# Altium schematic sheet ADC_01_HYB.SchDoc: ADC01 Hybrid
size A4; DrawnBy: HK; SheetNumber: 1; SheetTotal: 2; ProjectName: CoRDIA
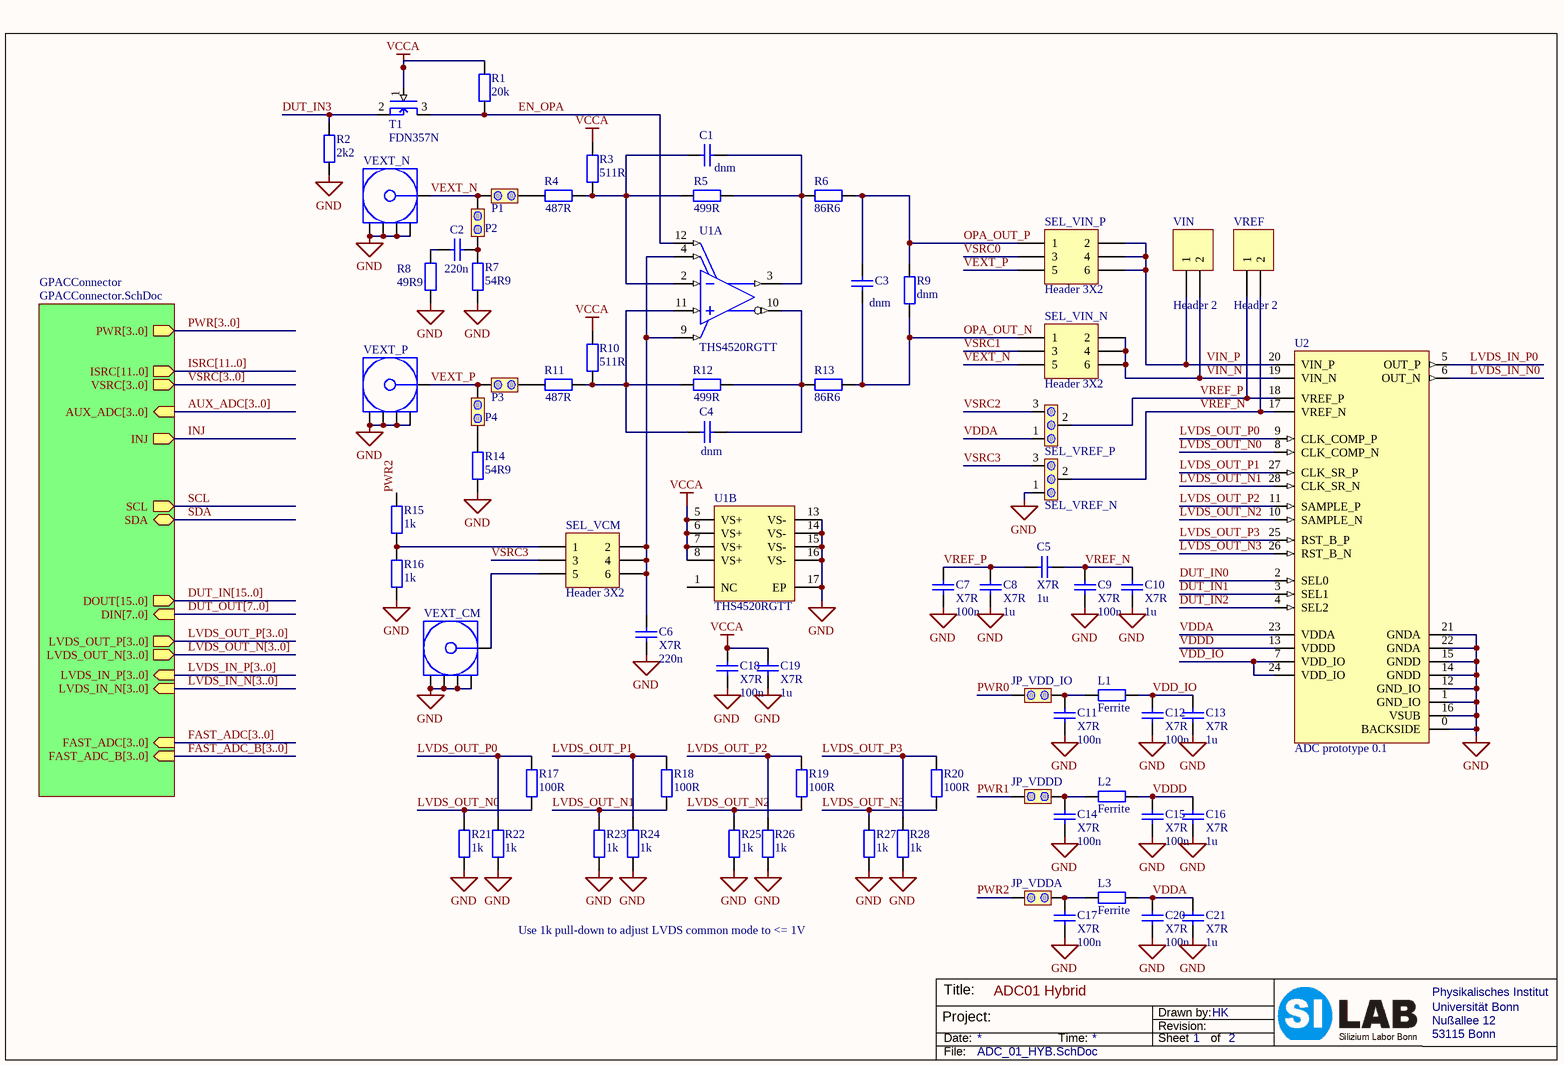
[diagram p0: ADC_01_HYB.SchDoc]

## Parts
C1  value dnm  [C0603_imp_N]  (hidden comment: X7R)
C2  value 220n  [C0603_imp_N]  (hidden comment: X7R)
C3  value dnm  [C0603_imp_N]  (hidden comment: X7R)
C4  value dnm  [C0603_imp_N]  (hidden comment: X7R)
C5  X7R  value 1u  [C0603_imp_N]
C6  X7R  value 220n  [C0603_imp_N]
C7  X7R  value 100n  [C0603_imp_N]
C8  X7R  value 1u  [C0603_imp_N]
C9  X7R  value 100n  [C0603_imp_N]
C10  X7R  value 1u  [C0603_imp_N]
C11  X7R  value 100n  [C0603_imp_N]
C12  X7R  value 100n  [C0603_imp_N]
C13  X7R  value 1u  [C0603_imp_N]
C14  X7R  value 100n  [C0603_imp_N]
C15  X7R  value 100n  [C0603_imp_N]
C16  X7R  value 1u  [C0603_imp_N]
C17  X7R  value 100n  [C0603_imp_N]
C18  X7R  value 100n  [C0603_imp_N]
C19  X7R  value 1u  [C0603_imp_N]
C20  X7R  value 100n  [C0603_imp_N]
C21  X7R  value 1u  [C0603_imp_N]
JP_VDD_IO  -  [CON 1x2 std]  (value not drawn)
JP_VDDA  -  [CON 1x2 std]  (value not drawn)
JP_VDDD  -  [CON 1x2 std]  (value not drawn)
L1  value Ferrite  [R0603_imp_N]  (hidden comment: R)
L2  value Ferrite  [R0603_imp_N]  (hidden comment: R)
L3  value Ferrite  [R0603_imp_N]  (hidden comment: R)
P1  -  [CON 1x2 std]  (value not drawn)
P2  -  [CON 1x2 std]  (value not drawn)
P3  -  [CON 1x2 std]  (value not drawn)
P4  -  [CON 1x2 std]  (value not drawn)
R1  value 20k  [R0603_imp_N]  (hidden comment: R)
R2  value 2k2  [R0603_imp_N]  (hidden comment: R)
R3  value 511R  [R0603_imp_N]  (hidden comment: R)
R4  value 487R  [R0603_imp_N]  (hidden comment: R)
R5  value 499R  [R0603_imp_N]  (hidden comment: R)
R6  value 86R6  [R0603_imp_N]  (hidden comment: R)
R7  value 54R9  [R0603_imp_N]  (hidden comment: R)
R8  value 49R9  [R0603_imp_N]  (hidden comment: R)
R9  value dnm  [R0603_imp_N]  (hidden comment: R)
R10  value 511R  [R0603_imp_N]  (hidden comment: R)
R11  value 487R  [R0603_imp_N]  (hidden comment: R)
R12  value 499R  [R0603_imp_N]  (hidden comment: R)
R13  value 86R6  [R0603_imp_N]  (hidden comment: R)
R14  value 54R9  [R0603_imp_N]  (hidden comment: R)
R15  value 1k  [R0603_imp_N]  (hidden comment: R)
R16  value 1k  [R0603_imp_N]  (hidden comment: R)
R17  value 100R  [R0603_imp_N]  (hidden comment: R)
R18  value 100R  [R0603_imp_N]  (hidden comment: R)
R19  value 100R  [R0603_imp_N]  (hidden comment: R)
R20  value 100R  [R0603_imp_N]  (hidden comment: R)
R21  value 1k  [R0603_imp_N]  (hidden comment: R)
R22  value 1k  [R0603_imp_N]  (hidden comment: R)
R23  value 1k  [R0603_imp_N]  (hidden comment: R)
R24  value 1k  [R0603_imp_N]  (hidden comment: R)
R25  value 1k  [R0603_imp_N]  (hidden comment: R)
R26  value 1k  [R0603_imp_N]  (hidden comment: R)
R27  value 1k  [R0603_imp_N]  (hidden comment: R)
R28  value 1k  [R0603_imp_N]  (hidden comment: R)
SEL_VCM  Header 3X2  [HDR2X3]
SEL_VIN_N  Header 3X2  [HDR2X3]
SEL_VIN_P  Header 3X2  [HDR2X3]
SEL_VREF_N  -  [HDR 1x3]  (value not drawn)
SEL_VREF_P  -  [HDR 1x3]  (value not drawn)
T1  FDN357N  [SOT23]
U1  THS4520RGTT  [RGT0016A_V]  (parts A,B of 2)
U2  ADC prototype 0.1  [ADC01]
VEXT_CM  -  [SMASTEHEND]  (value not drawn)
VEXT_N  -  [SMASTEHEND]  (value not drawn)
VEXT_P  -  [SMASTEHEND]  (value not drawn)
VIN  Header 2  [HDR1X2]
VREF  Header 2  [HDR1X2]

## Sub-sheets
GPACConnector = GPACConnector.SchDoc: PWR[3..0] (out), ISRC[11..0] (out), VSRC[3..0] (out), AUX_ADC[3..0] (in), DOUT[15..0] (out), DIN[7..0] (in), FAST_ADC[3..0] (in), FAST_ADC_B[3..0] (in), INJ (out), SDA (bidir), SCL (out), LVDS_IN_P[3..0] (in), LVDS_OUT_P[3..0] (out), LVDS_IN_N[3..0] (in), LVDS_OUT_N[3..0] (out)

## Nets
GND: C6.2 C7.2 C8.2 C9.2 C10.2 C11.2 C12.2 C13.2 C14.2 C15.2 C16.2 C17.2 C18.2 C19.2 C20.2 C21.2 R2.2 R7.2 R8.2 R14.2 R16.2 R21.2 R22.2 R23.2 R24.2 R25.2 R26.2 R27.2 R28.2 SEL_VREF_N.1 U1.13(VS-) U1.14(VS-) U1.15(VS-) U1.16(VS-) U1.17(EP) U2.0(BACKSIDE) U2.1(GND_IO) U2.12(GND_IO) U2.14(GNDD) U2.15(GNDD) U2.16(VSUB) U2.21(GNDA) U2.22(GNDA) VEXT_CM.2(GND) VEXT_CM.3(GND) VEXT_CM.4(GND) VEXT_CM.5(GND) VEXT_N.2(GND) VEXT_N.3(GND) VEXT_N.4(GND) VEXT_N.5(GND) VEXT_P.2(GND) VEXT_P.3(GND) VEXT_P.4(GND) VEXT_P.5(GND)
VCCA: C18.1 C19.1 R1.1 R3.1 R10.1 T1.1(G) U1.5(VS+) U1.6(VS+) U1.7(VS+) U1.8(VS+)
DUT_IN0: U2.2(SEL0)
DUT_IN1: U2.3(SEL1)
DUT_IN2: U2.4(SEL2)
DUT_IN3: R2.1 T1.2(S)
EN_OPA: R1.2 T1.3(D) U1.12(~{PD})
INJ: sheet GPACConnector/INJ
LVDS_IN_N0: U2.6(OUT_N)
LVDS_IN_P0: U2.5(OUT_P)
LVDS_OUT_N0: R17.2 R21.1 U2.8(CLK_COMP_N)
LVDS_OUT_N1: R18.2 R23.1 U2.28(CLK_SR_N)
LVDS_OUT_N2: R19.2 R25.1 U2.10(SAMPLE_N)
LVDS_OUT_N3: R20.2 R27.1 U2.26(RST_B_N)
LVDS_OUT_P0: R17.1 R22.1 U2.9(CLK_COMP_P)
LVDS_OUT_P1: R18.1 R24.1 U2.27(CLK_SR_P)
LVDS_OUT_P2: R19.1 R26.1 U2.11(SAMPLE_P)
LVDS_OUT_P3: R20.1 R28.1 U2.25(RST_B_P)
OPA_OUT_N: C3.2 R9.1 R13.1 SEL_VIN_N.1
OPA_OUT_P: C3.1 R6.1 R9.2 SEL_VIN_P.1
PWR0: JP_VDD_IO.1
PWR1: JP_VDDD.1
PWR2: JP_VDDA.1 R15.1
SCL: sheet GPACConnector/SCL
SDA: sheet GPACConnector/SDA
VDD_IO: C12.1 C13.1 L1.2 U2.7(VDD_IO) U2.24(VDD_IO)
VDDA: C20.1 C21.1 L3.2 SEL_VREF_P.1 U2.23(VDDA)
VDDD: C15.1 C16.1 L2.2 U2.13(VDDD)
VEXT_N: P1.2 P2.2 SEL_VIN_N.5 VEXT_N.1(Signal)
VEXT_P: P3.2 P4.2 SEL_VIN_P.5 VEXT_P.1(Signal)
VIN_N: SEL_VIN_N.2 SEL_VIN_N.4 SEL_VIN_N.6 U2.19(VIN_N) VIN.2
VIN_P: SEL_VIN_P.2 SEL_VIN_P.4 SEL_VIN_P.6 U2.20(VIN_P) VIN.1
VREF_N: C5.2 C9.1 C10.1 SEL_VREF_N.2 U2.17(VREF_N) VREF.2
VREF_P: C5.1 C7.1 C8.1 SEL_VREF_P.2 U2.18(VREF_P) VREF.1
VSRC0: SEL_VIN_P.3
VSRC1: SEL_VIN_N.3
VSRC2: SEL_VREF_P.3
VSRC3: SEL_VCM.3 SEL_VREF_N.3
NetC1_1: C1.1 R3.2 R4.2 R5.1 U1.2(VIN-)
NetC1_2: C1.2 R5.2 R6.2 U1.3(VOUT+)
NetC2_1: C2.1 R8.1
NetC2_2: C2.2 P2.1 R7.1
NetC4_1: C4.1 R10.2 R11.2 R12.1 U1.11(VIN+)
NetC4_2: C4.2 R12.2 R13.2 U1.10(VOUT-)
NetC6_1: C6.1 SEL_VCM.2 SEL_VCM.4 SEL_VCM.6 U1.4(CM) U1.9(CM)
NetC11_1: C11.1 JP_VDD_IO.2 L1.1
NetC14_1: C14.1 JP_VDDD.2 L2.1
NetC17_1: C17.1 JP_VDDA.2 L3.1
NetP1_1: P1.1 R4.1
NetP3_1: P3.1 R11.1
NetP4_1: P4.1 R14.1
NetR15_2: R15.2 R16.1 SEL_VCM.1
NetSEL_VCM_5: SEL_VCM.5 VEXT_CM.1(Signal)

Not connected (* = marked no-connect by the designer): U1 1(NC)

## Buses and harness runs
bus AUX_ADC[3..0] = sheet GPACConnector/AUX_ADC[3..0]
bus DUT_IN[15..0] = sheet GPACConnector/DOUT[15..0]
bus DUT_OUT[7..0] = sheet GPACConnector/DIN[7..0]
bus FAST_ADC[3..0] = sheet GPACConnector/FAST_ADC[3..0]
bus FAST_ADC_B[3..0] = sheet GPACConnector/FAST_ADC_B[3..0]
bus ISRC[11..0] = sheet GPACConnector/ISRC[11..0]
bus LVDS_IN_N[3..0] = sheet GPACConnector/LVDS_IN_N[3..0]
bus LVDS_IN_P[3..0] = sheet GPACConnector/LVDS_IN_P[3..0]
bus LVDS_OUT_N[3..0] = sheet GPACConnector/LVDS_OUT_N[3..0]
bus LVDS_OUT_P[3..0] = sheet GPACConnector/LVDS_OUT_P[3..0]
bus PWR[3..0] = sheet GPACConnector/PWR[3..0]
bus VSRC[3..0] = sheet GPACConnector/VSRC[3..0]

## Notes on the sheet
- Use 1k pull-down to adjust LVDS common mode to <= 1V
- Title:
- Drawn by:
- Physikalisches Institut
- Universität Bonn
- Project:
- Date:
- File:
- Time:
- Revision:
- Sheet
- of
- Nußallee 12
- 53115 Bonn

## Library data of the parts
C1-C21 = C: Capacitor; Constraints: 6.3V; Class: Passive; Type_1: SMD Chip Capacitor; Comment_1: -; LatestRevisionDate: 27-Nov-2007; Publisher: Silab J.S.; HelpURL: -; PackageDescription: -
JP_VDD_IO JP_VDDA JP_VDDD P1-P4 = JUMPER 1X2S: Jumper, Solderbridge 1x2; Class: Connector; Comment_1: -; Constraints: -; HelpURL: -; LatestRevisionDate: 24-Sep-2008; Publisher: Silab C.H.; Type_1: -; Value: -; PackageDescription: -
L1-L3 R1-R28 = R: SMD Chip Resistor; Constraints: 1%; Class: Passive; Comment_1: -; Publisher: Silab J.S.; LatestRevisionDate: 27-Nov-2007; HelpURL: -; Type_1: SMD Chip Resistor; PackageDescription: -
SEL_VCM SEL_VIN_N SEL_VIN_P = Header 3X2: Header, 3-Pin, Dual row; LatestRevisionDate: 17-Jul-2002; LatestRevisionNote: Re-released for DXP Platform.; Publisher: Altium Limited
SEL_VREF_N SEL_VREF_P = JUMPER 1X3S: Jumper, Solderbridge 1x3; Class: Connector; Comment_1: -; Constraints: -; HelpURL: -; LatestRevisionDate: 24-Sep-2008; Publisher: Silab C.H.; Type_1: -; Value: -; PackageDescription: -
T1 = T NMOS: NMOS Transistor SMD; Class: Discrete Silicon; Value: -; Constraints: -; Comment_1: -; HelpURL: -; Publisher: Silab J.S.; LatestRevisionDate: 02-Oct-2008; Type_1: FDN357N; PackageDescription: -
U1 = CMP-0811-00255-2: Rail-to-Rail Output Wideband Fully Differential Amplifier, 3 to 5.25 V, -40 to 85 degC, 16-pin QFN (RGT16), Green (RoHS & no Sb/Br); Manufacturer: Texas Instruments; Iq per channel(Max)(mA): 15.3; Rail-Rail: Out; Settling Time (0.1%)(Typ)(ns): 7; Io(Typ)(mA): 105; Vs(Min)(V): 3; BW @ Acl(MHz): 620; Vs(Max)(V): 5.25; Vn at Flatband(Typ)(nV/rtHz): 2; Number of Channels: 1; Vio(Max)(mV): 2.5; Slew Rate(Typ)(V/us): 570; @ MHz: 0.1; 2nd Harmonic(dBc): 115; 3rd Harmonic(dBc): 123; ComponentLink3URL: http://www.ti.com/litv/pdf/mpqf119g; Code_JEDEC: MO-220; Eco-Plan: Green (RoHS & no Sb/Br); ComponentLink2Description: Datasheet; ComponentLink3Description: Package Specification; ComponentLink1Description: Manufacturer URL; PackageVersion: 4203495/H, 10/2011; PackageReference: RGT0016A; ComponentLink2URL: http://www.ti.com/general/docs/lit/getliterature.tsp?genericPartNumber=THS4520&fileType=pdf; PackageDescription: 16-Pin Plastic Flat Pack, Body 3 x 3 mm, Pitch 0.5 mm; SubFamily: Fully Differential Amplifier; ComponentLink1URL: http://www.ti.com/; Offset Voltage Drift (+/-)(Max)(uV/Degrees Celsius: 1; Mounting Technology: Surface Mount; DatasheetVersion: SLOS503B; PartNumber: THS4520RGTT
U2 = ADC01
VEXT_CM VEXT_N VEXT_P = SMA: MCX RF Coaxial PCB Connector, Thru-Hole, Vertical Mount Socket, Blunt Post Terminal, 50 Ohm Impedance; Class: Connector; Comment_1: -; Constraints: -; HelpURL: http://www.amphenolrf.com/pdf/21.pdf; LatestRevisionDate: 24-Sep-2008; Publisher: Silab C.H.; Type_1: -; Value: -; PackageDescription: -
VIN VREF = Header 2: Header, 2-Pin; LatestRevisionDate: 17-Jul-2002; LatestRevisionNote: Re-released for DXP Platform.; Publisher: Altium Limited